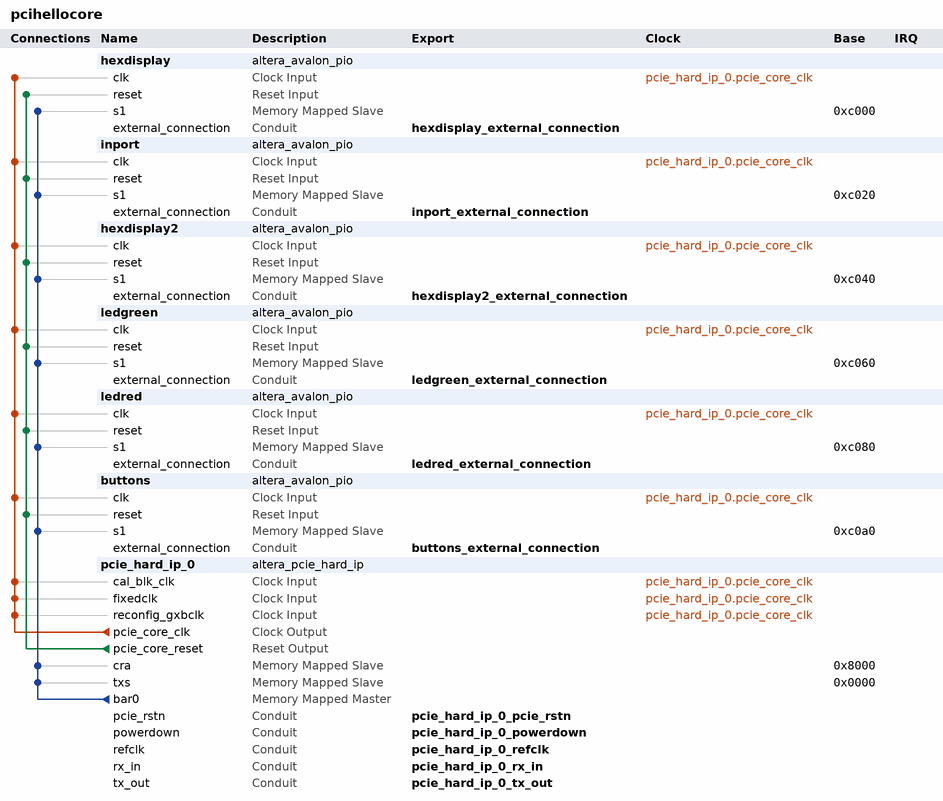
[diagram p0: system contents]
# Platform Designer (Qsys) system pcihellocore, Cyclone IV GX EP4CGX150DF31C7
# Parameters at their usual value, and those the tool derives, are not listed.
package require -exact qsys 14.0
create_system pcihellocore
set_project_property DEVICE_FAMILY {Cyclone IV GX}
set_project_property DEVICE EP4CGX150DF31C7

add_instance hexdisplay altera_avalon_pio 14.0
set_instance_parameter_value hexdisplay direction Output
set_instance_parameter_value hexdisplay resetValue 1077952576
set_instance_parameter_value hexdisplay width 32

add_instance inport altera_avalon_pio 14.0
set_instance_parameter_value inport direction Input
set_instance_parameter_value inport width 16

add_instance hexdisplay2 altera_avalon_pio 14.0
set_instance_parameter_value hexdisplay2 direction Output
set_instance_parameter_value hexdisplay2 resetValue 1077952576
set_instance_parameter_value hexdisplay2 width 32

add_instance ledgreen altera_avalon_pio 14.0
set_instance_parameter_value ledgreen direction Output
set_instance_parameter_value ledgreen width 32

add_instance ledred altera_avalon_pio 14.0
set_instance_parameter_value ledred direction Output
set_instance_parameter_value ledred width 32

add_instance buttons altera_avalon_pio 14.0
set_instance_parameter_value buttons direction Input
set_instance_parameter_value buttons width 32

add_instance pcie_hard_ip_0 altera_pcie_hard_ip 14.0
set_instance_parameter_value pcie_hard_ip_0 p_pcie_test_out_width None
set_instance_parameter_value pcie_hard_ip_0 {BAR Type} {32 bit Non-Prefetchable,Not used,Not used,Not used,Not used,Not used}
set_instance_parameter_value pcie_hard_ip_0 vendor_id 4466
set_instance_parameter_value pcie_hard_ip_0 device_id 4
set_instance_parameter_value pcie_hard_ip_0 class_code 0
set_instance_parameter_value pcie_hard_ip_0 subsystem_vendor_id 4466
set_instance_parameter_value pcie_hard_ip_0 subsystem_device_id 4
set_instance_parameter_value pcie_hard_ip_0 my_advanced_errors false
set_instance_parameter_value pcie_hard_ip_0 my_enable_ecrc_check false
set_instance_parameter_value pcie_hard_ip_0 my_enable_ecrc_gen false
set_instance_parameter_value pcie_hard_ip_0 CG_NO_CPL_REORDERING 0
set_instance_parameter_value pcie_hard_ip_0 CG_ENABLE_A2P_INTERRUPT 0
set_instance_parameter_value pcie_hard_ip_0 p_user_msi_enable 0
set_instance_parameter_value pcie_hard_ip_0 CB_A2P_ADDR_MAP_PASS_THRU_BITS 15
set_instance_parameter_value pcie_hard_ip_0 {PCIe Address 63:32} 0x00000000,0x00000000,0x00000000,0x00000000,0x00000000,0x00000000,0x00000000,0x00000000,0x00000000,0x00000000,0x00000000,0x00000000,0x00000000,0x00000000,0x00000000,0x00000000
set_instance_parameter_value pcie_hard_ip_0 {PCIe Address 31:0} 0x00000000,0x00000000,0x00000000,0x00000000,0x00000000,0x00000000,0x00000000,0x00000000,0x00000000,0x00000000,0x00000000,0x00000000,0x00000000,0x00000000,0x00000000,0x00000000

# connections
add_connection pcie_hard_ip_0.pcie_core_clk buttons.clk clock
add_connection pcie_hard_ip_0.pcie_core_clk hexdisplay2.clk clock
add_connection pcie_hard_ip_0.pcie_core_clk hexdisplay.clk clock
add_connection pcie_hard_ip_0.pcie_core_clk inport.clk clock
add_connection pcie_hard_ip_0.pcie_core_clk ledgreen.clk clock
add_connection pcie_hard_ip_0.pcie_core_clk ledred.clk clock
add_connection pcie_hard_ip_0.pcie_core_clk pcie_hard_ip_0.cal_blk_clk clock
add_connection pcie_hard_ip_0.pcie_core_clk pcie_hard_ip_0.fixedclk clock
add_connection pcie_hard_ip_0.pcie_core_clk pcie_hard_ip_0.reconfig_gxbclk clock
add_connection pcie_hard_ip_0.pcie_core_reset buttons.reset reset
add_connection pcie_hard_ip_0.pcie_core_reset hexdisplay2.reset reset
add_connection pcie_hard_ip_0.pcie_core_reset hexdisplay.reset reset
add_connection pcie_hard_ip_0.pcie_core_reset inport.reset reset
add_connection pcie_hard_ip_0.pcie_core_reset ledgreen.reset reset
add_connection pcie_hard_ip_0.pcie_core_reset ledred.reset reset
add_connection pcie_hard_ip_0.bar0 buttons.s1 avalon
set_connection_parameter_value pcie_hard_ip_0.bar0/buttons.s1 baseAddress 0xc0a0
add_connection pcie_hard_ip_0.bar0 hexdisplay2.s1 avalon
set_connection_parameter_value pcie_hard_ip_0.bar0/hexdisplay2.s1 baseAddress 0xc040
add_connection pcie_hard_ip_0.bar0 hexdisplay.s1 avalon
set_connection_parameter_value pcie_hard_ip_0.bar0/hexdisplay.s1 baseAddress 0xc000
add_connection pcie_hard_ip_0.bar0 inport.s1 avalon
set_connection_parameter_value pcie_hard_ip_0.bar0/inport.s1 baseAddress 0xc020
add_connection pcie_hard_ip_0.bar0 ledgreen.s1 avalon
set_connection_parameter_value pcie_hard_ip_0.bar0/ledgreen.s1 baseAddress 0xc060
add_connection pcie_hard_ip_0.bar0 ledred.s1 avalon
set_connection_parameter_value pcie_hard_ip_0.bar0/ledred.s1 baseAddress 0xc080
add_connection pcie_hard_ip_0.bar0 pcie_hard_ip_0.cra avalon
set_connection_parameter_value pcie_hard_ip_0.bar0/pcie_hard_ip_0.cra baseAddress 0x8000
add_connection pcie_hard_ip_0.bar0 pcie_hard_ip_0.txs avalon
set_connection_parameter_value pcie_hard_ip_0.bar0/pcie_hard_ip_0.txs baseAddress 0x0000

# exported interfaces
add_interface pcie_hard_ip_0_rx_in conduit end
set_interface_property pcie_hard_ip_0_rx_in EXPORT_OF pcie_hard_ip_0.rx_in
add_interface pcie_hard_ip_0_tx_out conduit end
set_interface_property pcie_hard_ip_0_tx_out EXPORT_OF pcie_hard_ip_0.tx_out
add_interface pcie_hard_ip_0_powerdown conduit end
set_interface_property pcie_hard_ip_0_powerdown EXPORT_OF pcie_hard_ip_0.powerdown
add_interface pcie_hard_ip_0_refclk conduit end
set_interface_property pcie_hard_ip_0_refclk EXPORT_OF pcie_hard_ip_0.refclk
add_interface pcie_hard_ip_0_pcie_rstn conduit end
set_interface_property pcie_hard_ip_0_pcie_rstn EXPORT_OF pcie_hard_ip_0.pcie_rstn
add_interface hexdisplay_external_connection conduit end
set_interface_property hexdisplay_external_connection EXPORT_OF hexdisplay.external_connection
add_interface inport_external_connection conduit end
set_interface_property inport_external_connection EXPORT_OF inport.external_connection
add_interface hexdisplay2_external_connection conduit end
set_interface_property hexdisplay2_external_connection EXPORT_OF hexdisplay2.external_connection
add_interface ledgreen_external_connection conduit end
set_interface_property ledgreen_external_connection EXPORT_OF ledgreen.external_connection
add_interface ledred_external_connection conduit end
set_interface_property ledred_external_connection EXPORT_OF ledred.external_connection
add_interface buttons_external_connection conduit end
set_interface_property buttons_external_connection EXPORT_OF buttons.external_connection

set_interconnect_requirement {$system} qsys_mm.clockCrossingAdapter HANDSHAKE
set_interconnect_requirement {$system} qsys_mm.maxAdditionalLatency 1

save_system pcihellocore.qsys
